# EAGLE design stm32G031J6M6-Breakout (EAGLE 9.6.2)
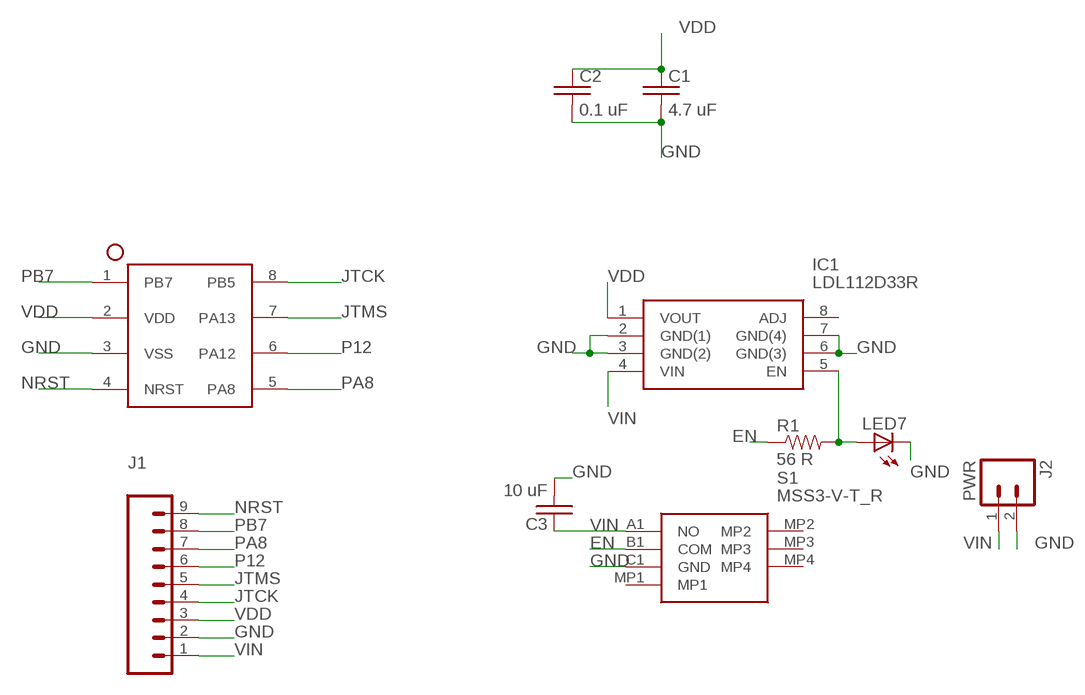
[diagram p0: schematic, sheet 1]

## Parts
C1  4.7 uF  C-USC0805K  [C0805K]
C2  0.1 uF  C-USC0805K  [C0805K]
C3  10 uF  C-USC0805K  [C0805K]
IC1  LDL112D33R  [SOIC127P600X175-8N]
J1  M09LONGPADS  [1X09_LONGPADS]
J2  PWR  M025MM  [SCREWTERMINAL-5MM-2]
LED7  LED1206  [LED-1206]
R1  56 R  RESISTOR1206  [1206]
S1  MSS3-V-T_R  [MSS3VTR]
U$1  STM32G031S08N  [SOIC127P600X175-8N]

## Nets
EN: R1.1 S1.B1(COM)
GND: C1.2 C2.2 C3.2 IC1.2(GND(1)) IC1.3(GND(2)) IC1.6(GND(3)) IC1.7(GND(4)) J1.2 J2.2 LED7.C S1.C1(GND) U$1.3(VSS)
JTCK: J1.4 U$1.8(PB5)
JTMS: J1.5 U$1.7(PA13)
N$14: IC1.5(EN) LED7.A R1.2
NRST: J1.9 U$1.4(NRST)
P12: J1.6 U$1.6(PA12)
PA8: J1.7 U$1.5(PA8)
PB7: J1.8 U$1.1(PB7)
VDD: C1.1 C2.1 IC1.1(VOUT) J1.3 U$1.2(VDD)
VIN: C3.1 IC1.4(VIN) J1.1 J2.1 S1.A1(NO)
Unconnected: IC1.8(ADJ) S1.MP1 S1.MP2 S1.MP3 S1.MP4

## Library data of the parts
C1-C3 = passives:C-US: CAPACITOR, American symbol
IC1 = voltage-regulator:LDL112D33R: LDO Voltage Regulators 1.2 A low quiescent current LDO with reverse current protection Source: Datasheet <https://www.arrow.com/en/products/ldl112d33r/stmicroelectronics>; ARROW_PART_NUMBER: LDL112D33R; ARROW_PRICE/STOCK: https://www.arrow.com/en/products/ldl112d33r/stmicroelectronics; DESCRIPTION: LDO Voltage Regulators 1.2 A low quiescent current LDO with reverse current protection; HEIGHT: 1.75mm; MANUFACTURER_NAME: STMicroelectronics; MANUFACTURER_PART_NUMBER: LDL112D33R
J1 = connector:M09: Header 9 Standard 9-pin 0.1" header. Use with straight break away headers (SKU : PRT-00116), right angle break away headers (PRT-00553), swiss pins (PRT-00743), machine pins (PRT-00117), and female headers (PRT-00115).
J2 = connector:M02: Standard 2-pin 0.1" header. Use with - straight break away headers ( PRT-00116) - right angle break away headers (PRT-00553) - swiss pins (PRT-00743) - machine pins (PRT-00117) - female headers (PRT-00115) Molex polarized connector foot print use with: PRT-08233 with associated crimp pins and housings. 2.54_SCREWTERM for use with PRT-10571. 3.5mm Screw Terminal footprints for PRT-08084 5mm Screw Terminal footprints for use with PRT-08432; STOREFRONT_ID: PRT-08432
LED7 = leds:LED: LEDs Standard schematic elements and footprints for 5mm, 3mm, 1206, and 0603 sized LEDs. 5mm - Spark Fun Electronics SKU : COM-00529 (and others)
R1 = passives:RESISTOR: Resistor Basic schematic elements and footprints for 0603, 1206, and PTH resistors.
S1 = switches:MSS3-V-T_R: Slide Switches Slide Type 1P2T (1.4mm height) Source: Datasheet <http://www.dip.com.tw/en/en-product-information/en-switch005/item/download/2643_3624e6da26abd0f9c3465d69564276ea>; DESCRIPTION: Slide Switches Slide Type 1P2T (1.4mm height); HEIGHT: 1.4mm; MANUFACTURER_NAME: Diptronics; MANUFACTURER_PART_NUMBER: MSS3-V-T/R; MOUSER_PART_NUMBER: 113-MSS3-V-T/R; MOUSER_PRICE-STOCK: https://www.mouser.com/Search/Refine.aspx?Keyword=113-MSS3-V-T%2FR
U$1 = ICs:STM32G031

## Board
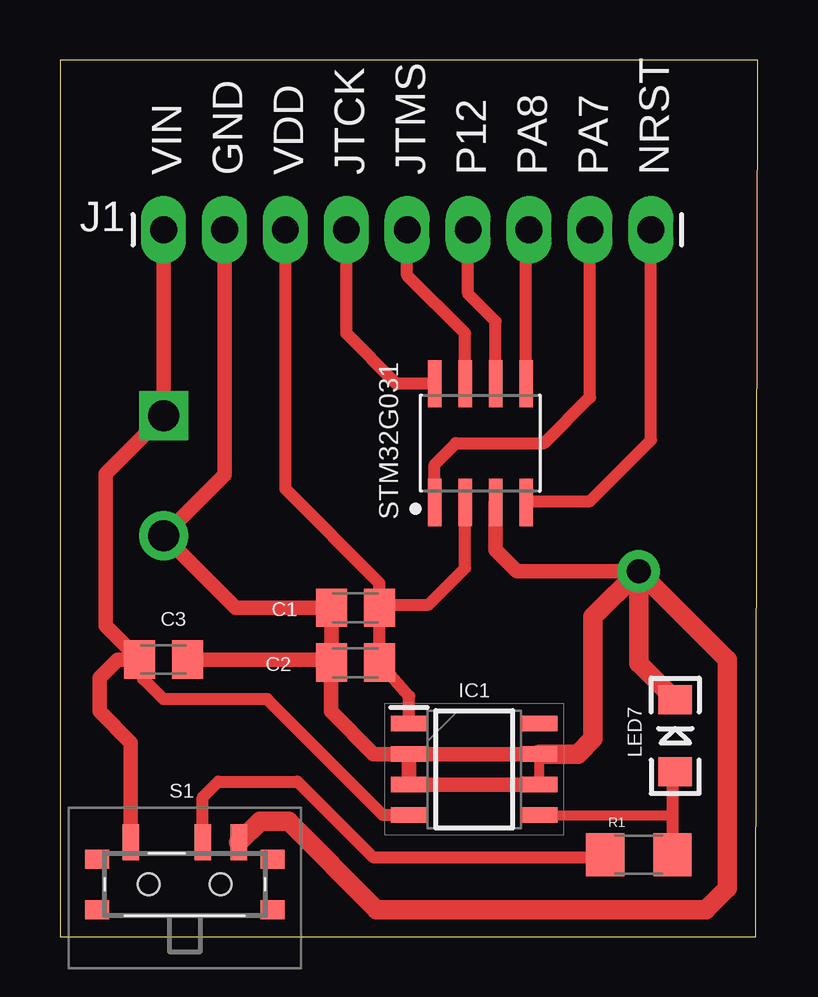
[diagram p1: board, top side]
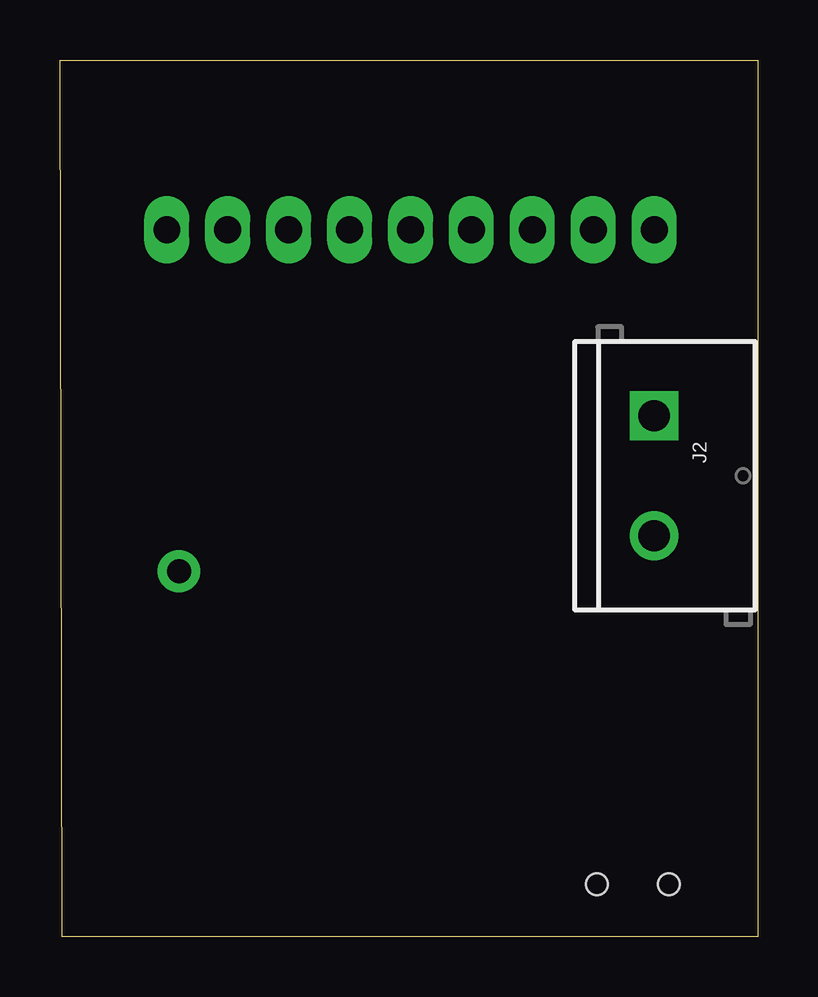
[diagram p2: board, bottom side, seen from below]

Size 29.09 x 36.54 mm. Coordinates in mm from the lower left corner, seen from the top.
Outline: 0,0 29,0 29.09,36.54 0,36.54 0,0
Copper layers (1*16): Top 0.035mm / dielectric 1.5mm / Bottom 0.035mm
Design rules "OthermillDRC_1_64_v2": minimum track width 16mil, minimum drill 31mil, track to track 0.39878125mm, track to pad 0.39878125mm, pad to pad 0.39878125mm, via to via 0.39878125mm, smd to smd 0mil, copper to edge 0mil, drill to drill 1mil, minimum pad ring 0mil, minimum via ring 15mil, stop-mask expansion 1mil, vias tented up to drill 30mil, thermal gap 10mil

### Footprints (pad centres in the part's own frame; a part is rotated, then mirrored left to right if it is on the bottom)
C0805K = smd 1.3 x 1.6: 1 -1,0; 2 1,0
SOIC127P600X175-8N = smd 1.525 x 0.65: 1 -2.712,1.905; 2 -2.712,0.635; 3 -2.712,-0.635; 4 -2.712,-1.905; 5 2.712,-1.905; 6 2.712,-0.635; 7 2.712,0.635; 8 2.712,1.905
1X09_LONGPADS = drill 1.118 pad 1.88 long: 1 0,0; 2 2.54,0; 3 5.08,0; 4 7.62,0; 5 10.16,0; 6 12.7,0; 7 15.24,0; 8 17.78,0; 9 20.32,0
SCREWTERMINAL-5MM-2 = drill 1.3 pad 2.032 square: 1 0,0 | drill 1.3 pad 2.032: 2 5,0
LED-1206 = smd 1.2 x 1.4: A -1.5,0; C 1.5,0
1206 = smd 1.6 x 1.8: 1 -1.4,0; 2 1.4,0
MSS3VTR = smd 0.7 x 1.5: A1 -2.25,3.05; B1 0.75,3.05; C1 2.25,3.05 | smd 1 x 0.8: MP1 -3.65,2.35; MP2 -3.65,0.25; MP3 3.65,0.25; MP4 3.65,2.35 | hole 0.9: -1.5,1.3; 1.5,1.3
SOIC127P600X175-8N' = smd 1.968 x 0.569: 1 -2.473,1.905; 2 -2.473,0.635; 3 -2.473,-0.635; 4 -2.473,-1.905; 5 2.473,-1.905; 6 2.473,-0.635; 7 2.473,0.635; 8 2.473,1.905

### Placement (x,y rotation side)
C1  12.32,13.72 180 top
C2  12.32,11.43 180 top
C3  4.32,11.56 0 top
IC1  17.27,6.99 0 top
J1  4.32,29.46 0 top
J2  4.32,21.72 270 bottom
LED7  25.65,8.38 90 top
R1  24.13,3.43 0 top
S1  5.21,0.89 0 top
U$1  STM32G031S08N  [SOIC127P600X175-8N']  17.53,20.57 90 top

### Tracks (layer width: path | path; a pad name or v marks a point on that pad's centre or on a via)
EN
  Top 0.508: S1.B1 5.96,5.83 6.6,6.48 9.91,6.48 13.08,3.3 22.6,3.3 R1.1
GND  (via drill 1)
  Top 0.406: IC1.6 IC1.7
  Top 0.61: U$1.3 18.16,16.13 19.05,15.24 v24.13,15.24 | IC1.7 IC1.2 | IC1.2 IC1.3 IC1.6 | IC1.2 13.08,7.62 11.3,9.4 11.3,11.41 | 11.3,11.41 C2.2 C1.2 7.32,13.72 J2.2 6.86,19.26 J1.2 | C3.2 11.16,11.56 11.3,11.41
  Top 0.813: S1.C1 8.34,4.83 9.53,4.83 13.21,1.14 26.92,1.14 27.81,2.03 27.81,11.56 v24.13,15.24 | LED7.C 24.13,11.41 v24.13,15.24 | IC1.7 21.59,7.62 22.23,8.26 22.23,13.34 v24.13,15.24
JTCK
  Top 0.508: U$1.8 14.04,23.05 11.94,25.15 J1.4
JTMS
  Top 0.508: J1.5 14.48,27.56 16.89,25.15 U$1.7
N$14
  Top 0.406: IC1.5 25.53,5.08
  Top 0.508: LED7.A 25.53,6.76 25.53,5.08 R1.2
NRST
  Top 0.508: U$1.4 19.49,18.16 22.1,18.16 24.64,20.7 J1.9
P12
  Top 0.508: U$1.6 18.16,25.65 17.02,26.8 J1.6
PA8
  Top 0.508: U$1.5 19.43,29.34 J1.7
PB7
  Top 0.508: U$1.1 15.62,19.68 16.51,20.57 20.19,20.57 22.1,22.48 J1.8
VDD
  Top 0.508: IC1.1 14.56,10.04 C2.1 C1.1 | C1.1 13.45,13.84 15.37,13.84 16.89,15.37 U$1.2 | C1.1 13.32,14.75 9.4,18.67 J1.3
VIN
  Top 0.508: IC1.4 13.46,5.08 8.64,9.91 4.32,9.91 3.47,10.76 C3.1
  Top 0.61: S1.A1 2.96,8.09 1.65,9.4 1.65,10.79 2.41,11.56 C3.1 1.91,12.97 1.91,19.3 J2.1 J1.1

### Text on the board
tNames: VIN | GND | VDD | JTCK | JTMS | P12 | PA8 | PA7 | NRST | STM32G031